# Altium schematic sheet AUX Power.SchDoc
size 297 x 209 mm; SheetNumber: 3; SheetTotal: 29
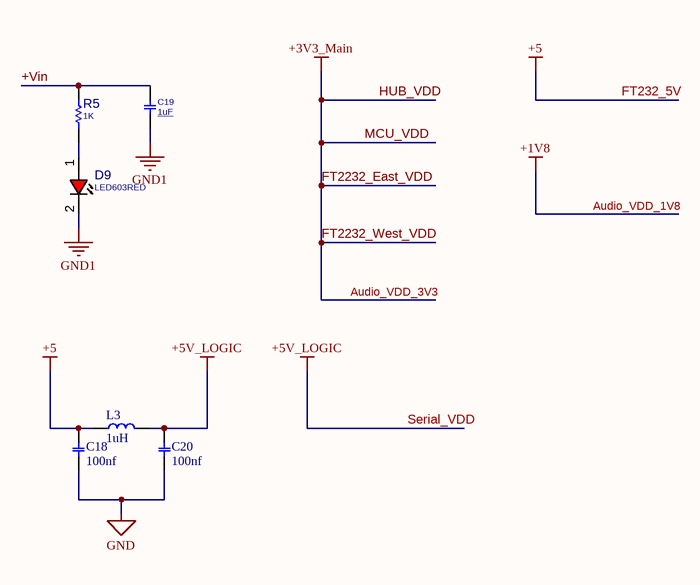
[diagram p0: AUX Power.SchDoc]

## Parts
C18  value 100nf  [C1206]  (hidden comment: Capacitor C SMD 1206)
C19  1uF  [0603]
C20  value 100nf  [C1206]  (hidden comment: Capacitor C SMD 1206)
D9  LED603RED  [LED0603RED]
L3  value 1uH  [L1812]  (hidden comment: Inductor SMD NC 1812)
R5  1K  [R0603]

## Nets
FT232_5V: C18.2 L3.1  [also labelled +5]
GND: C18.1 C20.1
GND1: C19.2 D9.2(CATHODE)
Serial_VDD: C20.2 L3.2  [also labelled +5V_LOGIC]
+Vin: C19.1 R5.2
NetD9_1: D9.1(ANODE) R5.1

## Notes on the sheet
- Drawn
- Name
- Date
- Drawing Title
- Checked
- Drawing No.
- Approved
- Size
- A4
- Ver.
- Rev.
- Sheet
- Of

## Library data of the parts
C19 = CAP_SMD_FILM_1u16v_1210: CAP, FILM, 1uF, 16V, Acryl, 20%, 1210; PARAM: Acrylic, MetallizedStacked, 20%, -40~85oC; MANF_P#: ECP-U1C105MA5; MANF: Panasonic; PRICE: 100= 36$; DESC: -; PARAM2: 16V; ASSEMBLY: ASSEMBLY; VALUE: 1uF
D9 = LED_SMD_0603_RED: LED, SMD, 0603, RED; PARAM: 30mA, 640nm; DESC: DESCRIPTION; MANF_P#: MANF_PART#; PARAM2: 1.8~2.5V; MANF: MANF; ASSEMBLY: ASSEMBLY; PRICE: PRICE; VALUE: LED603RED
R5 = RES_SMD_0603: RESISTOR, SMD; PARAM: -W; DESC: DESCRIPTION; DIST#: MOUSER; PARAM2: 1%; MANF_P#: -; MANF: -; ASSEMBLY: ASSEMBLY; PRICE: 100= 0.5$; VALUE: 1K
C18 C20 = Capacitor C SMD 1206: DatasheetVersion: 2021; ComponentLink1Description: Website Smart World; ComponentLink1URL: https://www.smartw.ir/; ComponentLink2Description: Telegram; ComponentLink2URL: https://t.me/altium_smartw; ComponentLink3Description: Instagram; ComponentLink3URL: https://Instagram.com/smartgw.ir
L3 = Inductor SMD NC 1812: DatasheetVersion: 2021; ComponentLink1Description: Website Smart World; ComponentLink1URL: https://www.smartw.ir/; ComponentLink2Description: Telegram; ComponentLink2URL: https://t.me/altium_smartw; ComponentLink3Description: Instagram; ComponentLink3URL: https://Instagram.com/smartgw.ir